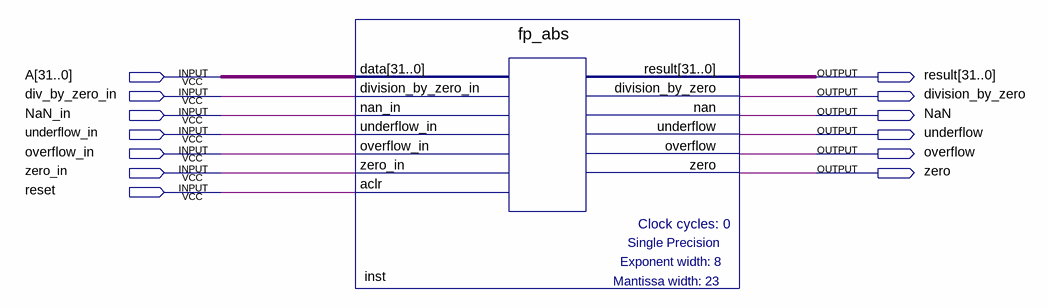
[diagram p0: schematic sheet]
// Quartus schematic fp_abs.bdf as structural Verilog: 1 symbols, 13 pins
module fp_abs (
  input  [31:0] A,
  input  div_by_zero_in,
  input  NaN_in,
  input  underflow_in,
  input  overflow_in,
  input  zero_in,
  input  reset,
  output [31:0] result,
  output division_by_zero,
  output NaN,
  output underflow,
  output overflow,
  output zero
);

  fp_abs inst (
    .data(A), .division_by_zero_in(div_by_zero_in), .nan_in(NaN_in), .underflow_in(underflow_in),
    .overflow_in(overflow_in), .zero_in(zero_in), .aclr(reset), .result(result),
    .division_by_zero(division_by_zero), .nan(NaN), .underflow(underflow), .overflow(overflow), .zero(zero));
endmodule
